# EAGLE schematic AutoPad-R1-RevA (EAGLE 9.6.2), part 2 of 2
## Sheet 6 of 6
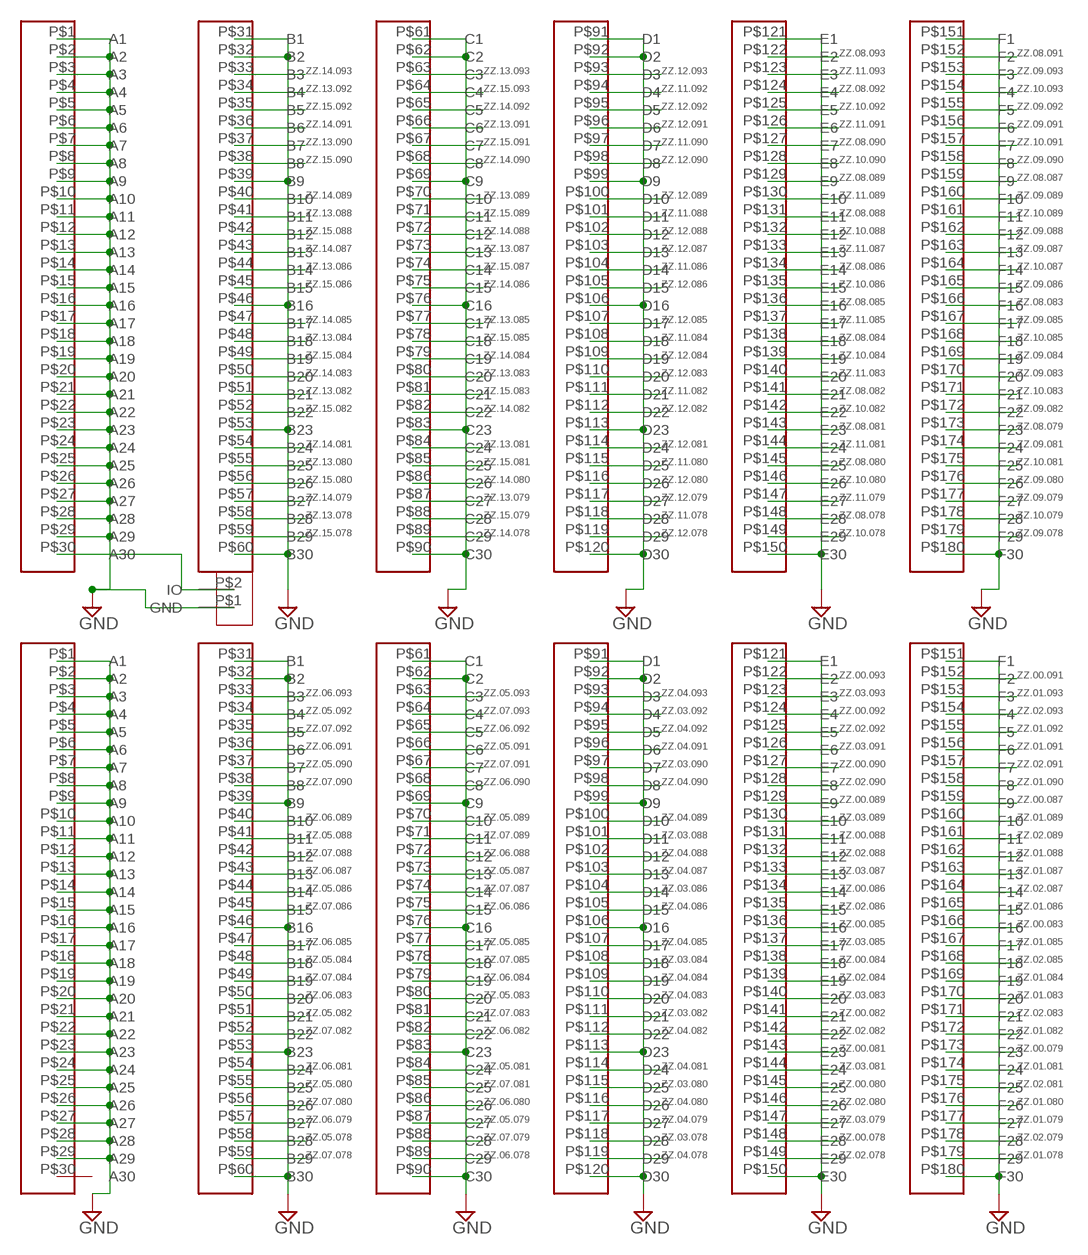
[diagram p5: schematic, sheet 6]

### Parts
U$11  SEAM-30-02.0-L-06-1-A-K-TR  [SEAM-30-02.0-L-06-1-A-K-TR]
U$12  SEAM-30-02.0-L-06-1-A-K-TR  [SEAM-30-02.0-L-06-1-A-K-TR]
U$18  DS2431  [SD2431]

### Nets
GND: U$11.P$1(A1) U$11.P$2(A2) U$11.P$3(A3) U$11.P$4(A4) U$11.P$5(A5) U$11.P$6(A6) U$11.P$7(A7) U$11.P$8(A8) U$11.P$9(A9) U$11.P$10(A10) U$11.P$11(A11) U$11.P$12(A12) U$11.P$13(A13) U$11.P$14(A14) U$11.P$15(A15) U$11.P$16(A16) U$11.P$17(A17) U$11.P$18(A18) U$11.P$19(A19) U$11.P$20(A20) U$11.P$21(A21) U$11.P$22(A22) U$11.P$23(A23) U$11.P$24(A24) U$11.P$25(A25) U$11.P$26(A26) U$11.P$27(A27) U$11.P$28(A28) U$11.P$29(A29) U$11.P$31(B1) U$11.P$32(B2) U$11.P$39(B9) U$11.P$46(B16) U$11.P$53(B23) U$11.P$60(B30) U$11.P$61(C1) U$11.P$62(C2) U$11.P$69(C9) U$11.P$76(C16) U$11.P$83(C23) U$11.P$90(C30) U$11.P$91(D1) U$11.P$92(D2) U$11.P$99(D9) U$11.P$106(D16) U$11.P$113(D23) U$11.P$120(D30) U$11.P$121(E1) U$11.P$150(E30) U$11.P$151(F1) U$11.P$180(F30) U$12.P$1(A1) U$12.P$2(A2) U$12.P$3(A3) U$12.P$4(A4) U$12.P$5(A5) U$12.P$6(A6) U$12.P$7(A7) U$12.P$8(A8) U$12.P$9(A9) U$12.P$10(A10) U$12.P$11(A11) U$12.P$12(A12) U$12.P$13(A13) U$12.P$14(A14) U$12.P$15(A15) U$12.P$16(A16) U$12.P$17(A17) U$12.P$18(A18) U$12.P$19(A19) U$12.P$20(A20) U$12.P$21(A21) U$12.P$22(A22) U$12.P$23(A23) U$12.P$24(A24) U$12.P$25(A25) U$12.P$26(A26) U$12.P$27(A27) U$12.P$28(A28) U$12.P$29(A29) U$12.P$31(B1) U$12.P$32(B2) U$12.P$39(B9) U$12.P$46(B16) U$12.P$53(B23) U$12.P$60(B30) U$12.P$61(C1) U$12.P$62(C2) U$12.P$69(C9) U$12.P$76(C16) U$12.P$83(C23) U$12.P$90(C30) U$12.P$91(D1) U$12.P$92(D2) U$12.P$99(D9) U$12.P$106(D16) U$12.P$113(D23) U$12.P$120(D30) U$12.P$121(E1) U$12.P$150(E30) U$12.P$151(F1) U$12.P$180(F30) U$18.P$1(GND) ; also sheet 1,2,3,4,5
N$6: U$11.P$30(A30) U$18.P$2(IO)
ZZ.00.078: U$12.P$148(E28)
ZZ.00.079: U$12.P$173(F23)
ZZ.00.080: U$12.P$145(E25)
ZZ.00.081: U$12.P$143(E23)
ZZ.00.082: U$12.P$141(E21)
ZZ.00.083: U$12.P$166(F16)
ZZ.00.084: U$12.P$138(E18)
ZZ.00.085: U$12.P$136(E16)
ZZ.00.086: U$12.P$134(E14)
ZZ.00.087: U$12.P$159(F9)
ZZ.00.088: U$12.P$131(E11)
ZZ.00.089: U$12.P$129(E9)
ZZ.00.090: U$12.P$127(E7)
ZZ.00.091: U$12.P$152(F2)
ZZ.00.092: U$12.P$124(E4)
ZZ.00.093: U$12.P$122(E2)
ZZ.01.078: U$12.P$179(F29)
ZZ.01.079: U$12.P$177(F27)
ZZ.01.080: U$12.P$176(F26)
ZZ.01.081: U$12.P$174(F24)
ZZ.01.082: U$12.P$172(F22)
ZZ.01.083: U$12.P$170(F20)
ZZ.01.084: U$12.P$169(F19)
ZZ.01.085: U$12.P$167(F17)
ZZ.01.086: U$12.P$165(F15)
ZZ.01.087: U$12.P$163(F13)
ZZ.01.088: U$12.P$162(F12)
ZZ.01.089: U$12.P$160(F10)
ZZ.01.090: U$12.P$158(F8)
ZZ.01.091: U$12.P$156(F6)
ZZ.01.092: U$12.P$155(F5)
ZZ.01.093: U$12.P$153(F3)
ZZ.02.078: U$12.P$149(E29)
ZZ.02.079: U$12.P$178(F28)
ZZ.02.080: U$12.P$146(E26)
ZZ.02.081: U$12.P$175(F25)
ZZ.02.082: U$12.P$142(E22)
ZZ.02.083: U$12.P$171(F21)
ZZ.02.084: U$12.P$139(E19)
ZZ.02.085: U$12.P$168(F18)
ZZ.02.086: U$12.P$135(E15)
ZZ.02.087: U$12.P$164(F14)
ZZ.02.088: U$12.P$132(E12)
ZZ.02.089: U$12.P$161(F11)
ZZ.02.090: U$12.P$128(E8)
ZZ.02.091: U$12.P$157(F7)
ZZ.02.092: U$12.P$125(E5)
ZZ.02.093: U$12.P$154(F4)
ZZ.03.078: U$12.P$118(D28)
ZZ.03.079: U$12.P$147(E27)
ZZ.03.080: U$12.P$115(D25)
ZZ.03.081: U$12.P$144(E24)
ZZ.03.082: U$12.P$111(D21)
ZZ.03.083: U$12.P$140(E20)
ZZ.03.084: U$12.P$108(D18)
ZZ.03.085: U$12.P$137(E17)
ZZ.03.086: U$12.P$104(D14)
ZZ.03.087: U$12.P$133(E13)
ZZ.03.088: U$12.P$101(D11)
ZZ.03.089: U$12.P$130(E10)
ZZ.03.090: U$12.P$97(D7)
ZZ.03.091: U$12.P$126(E6)
ZZ.03.092: U$12.P$94(D4)
ZZ.03.093: U$12.P$123(E3)
ZZ.04.078: U$12.P$119(D29)
ZZ.04.079: U$12.P$117(D27)
ZZ.04.080: U$12.P$116(D26)
ZZ.04.081: U$12.P$114(D24)
ZZ.04.082: U$12.P$112(D22)
ZZ.04.083: U$12.P$110(D20)
ZZ.04.084: U$12.P$109(D19)
ZZ.04.085: U$12.P$107(D17)
ZZ.04.086: U$12.P$105(D15)
ZZ.04.087: U$12.P$103(D13)
ZZ.04.088: U$12.P$102(D12)
ZZ.04.089: U$12.P$100(D10)
ZZ.04.090: U$12.P$98(D8)
ZZ.04.091: U$12.P$96(D6)
ZZ.04.092: U$12.P$95(D5)
ZZ.04.093: U$12.P$93(D3)
ZZ.05.078: U$12.P$58(B28)
ZZ.05.079: U$12.P$87(C27)
ZZ.05.080: U$12.P$55(B25)
ZZ.05.081: U$12.P$84(C24)
ZZ.05.082: U$12.P$51(B21)
ZZ.05.083: U$12.P$80(C20)
ZZ.05.084: U$12.P$48(B18)
ZZ.05.085: U$12.P$77(C17)
ZZ.05.086: U$12.P$44(B14)
ZZ.05.087: U$12.P$73(C13)
ZZ.05.088: U$12.P$41(B11)
ZZ.05.089: U$12.P$70(C10)
ZZ.05.090: U$12.P$37(B7)
ZZ.05.091: U$12.P$66(C6)
ZZ.05.092: U$12.P$34(B4)
ZZ.05.093: U$12.P$63(C3)
ZZ.06.078: U$12.P$89(C29)
ZZ.06.079: U$12.P$57(B27)
ZZ.06.080: U$12.P$86(C26)
ZZ.06.081: U$12.P$54(B24)
ZZ.06.082: U$12.P$82(C22)
ZZ.06.083: U$12.P$50(B20)
ZZ.06.084: U$12.P$79(C19)
ZZ.06.085: U$12.P$47(B17)
ZZ.06.086: U$12.P$75(C15)
ZZ.06.087: U$12.P$43(B13)
ZZ.06.088: U$12.P$72(C12)
ZZ.06.089: U$12.P$40(B10)
ZZ.06.090: U$12.P$68(C8)
ZZ.06.091: U$12.P$36(B6)
ZZ.06.092: U$12.P$65(C5)
ZZ.06.093: U$12.P$33(B3)
ZZ.07.078: U$12.P$59(B29)
ZZ.07.079: U$12.P$88(C28)
ZZ.07.080: U$12.P$56(B26)
ZZ.07.081: U$12.P$85(C25)
ZZ.07.082: U$12.P$52(B22)
ZZ.07.083: U$12.P$81(C21)
ZZ.07.084: U$12.P$49(B19)
ZZ.07.085: U$12.P$78(C18)
ZZ.07.086: U$12.P$45(B15)
ZZ.07.087: U$12.P$74(C14)
ZZ.07.088: U$12.P$42(B12)
ZZ.07.089: U$12.P$71(C11)
ZZ.07.090: U$12.P$38(B8)
ZZ.07.091: U$12.P$67(C7)
ZZ.07.092: U$12.P$35(B5)
ZZ.07.093: U$12.P$64(C4)
ZZ.08.078: U$11.P$148(E28)
ZZ.08.079: U$11.P$173(F23)
ZZ.08.080: U$11.P$145(E25)
ZZ.08.081: U$11.P$143(E23)
ZZ.08.082: U$11.P$141(E21)
ZZ.08.083: U$11.P$166(F16)
ZZ.08.084: U$11.P$138(E18)
ZZ.08.085: U$11.P$136(E16)
ZZ.08.086: U$11.P$134(E14)
ZZ.08.087: U$11.P$159(F9)
ZZ.08.088: U$11.P$131(E11)
ZZ.08.089: U$11.P$129(E9)
ZZ.08.090: U$11.P$127(E7)
ZZ.08.091: U$11.P$152(F2)
ZZ.08.092: U$11.P$124(E4)
ZZ.08.093: U$11.P$122(E2)
ZZ.09.078: U$11.P$179(F29)
ZZ.09.079: U$11.P$177(F27)
ZZ.09.080: U$11.P$176(F26)
ZZ.09.081: U$11.P$174(F24)
ZZ.09.082: U$11.P$172(F22)
ZZ.09.083: U$11.P$170(F20)
ZZ.09.084: U$11.P$169(F19)
ZZ.09.085: U$11.P$167(F17)
ZZ.09.086: U$11.P$165(F15)
ZZ.09.087: U$11.P$163(F13)
ZZ.09.088: U$11.P$162(F12)
ZZ.09.089: U$11.P$160(F10)
ZZ.09.090: U$11.P$158(F8)
ZZ.09.091: U$11.P$156(F6)
ZZ.09.092: U$11.P$155(F5)
ZZ.09.093: U$11.P$153(F3)
ZZ.10.078: U$11.P$149(E29)
ZZ.10.079: U$11.P$178(F28)
ZZ.10.080: U$11.P$146(E26)
ZZ.10.081: U$11.P$175(F25)
ZZ.10.082: U$11.P$142(E22)
ZZ.10.083: U$11.P$171(F21)
ZZ.10.084: U$11.P$139(E19)
ZZ.10.085: U$11.P$168(F18)
ZZ.10.086: U$11.P$135(E15)
ZZ.10.087: U$11.P$164(F14)
ZZ.10.088: U$11.P$132(E12)
ZZ.10.089: U$11.P$161(F11)
ZZ.10.090: U$11.P$128(E8)
ZZ.10.091: U$11.P$157(F7)
ZZ.10.092: U$11.P$125(E5)
ZZ.10.093: U$11.P$154(F4)
ZZ.11.078: U$11.P$118(D28)
ZZ.11.079: U$11.P$147(E27)
ZZ.11.080: U$11.P$115(D25)
ZZ.11.081: U$11.P$144(E24)
ZZ.11.082: U$11.P$111(D21)
ZZ.11.083: U$11.P$140(E20)
ZZ.11.084: U$11.P$108(D18)
ZZ.11.085: U$11.P$137(E17)
ZZ.11.086: U$11.P$104(D14)
ZZ.11.087: U$11.P$133(E13)
ZZ.11.088: U$11.P$101(D11)
ZZ.11.089: U$11.P$130(E10)
ZZ.11.090: U$11.P$97(D7)
ZZ.11.091: U$11.P$126(E6)
ZZ.11.092: U$11.P$94(D4)
ZZ.11.093: U$11.P$123(E3)
ZZ.12.078: U$11.P$119(D29)
ZZ.12.079: U$11.P$117(D27)
ZZ.12.080: U$11.P$116(D26)
ZZ.12.081: U$11.P$114(D24)
ZZ.12.082: U$11.P$112(D22)
ZZ.12.083: U$11.P$110(D20)
ZZ.12.084: U$11.P$109(D19)
ZZ.12.085: U$11.P$107(D17)
ZZ.12.086: U$11.P$105(D15)
ZZ.12.087: U$11.P$103(D13)
ZZ.12.088: U$11.P$102(D12)
ZZ.12.089: U$11.P$100(D10)
ZZ.12.090: U$11.P$98(D8)
ZZ.12.091: U$11.P$96(D6)
ZZ.12.092: U$11.P$95(D5)
ZZ.12.093: U$11.P$93(D3)
ZZ.13.078: U$11.P$58(B28)
ZZ.13.079: U$11.P$87(C27)
ZZ.13.080: U$11.P$55(B25)
ZZ.13.081: U$11.P$84(C24)
ZZ.13.082: U$11.P$51(B21)
ZZ.13.083: U$11.P$80(C20)
ZZ.13.084: U$11.P$48(B18)
ZZ.13.085: U$11.P$77(C17)
ZZ.13.086: U$11.P$44(B14)
ZZ.13.087: U$11.P$73(C13)
ZZ.13.088: U$11.P$41(B11)
ZZ.13.089: U$11.P$70(C10)
ZZ.13.090: U$11.P$37(B7)
ZZ.13.091: U$11.P$66(C6)
ZZ.13.092: U$11.P$34(B4)
ZZ.13.093: U$11.P$63(C3)
ZZ.14.078: U$11.P$89(C29)
ZZ.14.079: U$11.P$57(B27)
ZZ.14.080: U$11.P$86(C26)
ZZ.14.081: U$11.P$54(B24)
ZZ.14.082: U$11.P$82(C22)
ZZ.14.083: U$11.P$50(B20)
ZZ.14.084: U$11.P$79(C19)
ZZ.14.085: U$11.P$47(B17)
ZZ.14.086: U$11.P$75(C15)
ZZ.14.087: U$11.P$43(B13)
ZZ.14.088: U$11.P$72(C12)
ZZ.14.089: U$11.P$40(B10)
ZZ.14.090: U$11.P$68(C8)
ZZ.14.091: U$11.P$36(B6)
ZZ.14.092: U$11.P$65(C5)
ZZ.14.093: U$11.P$33(B3)
ZZ.15.078: U$11.P$59(B29)
ZZ.15.079: U$11.P$88(C28)
ZZ.15.080: U$11.P$56(B26)
ZZ.15.081: U$11.P$85(C25)
ZZ.15.082: U$11.P$52(B22)
ZZ.15.083: U$11.P$81(C21)
ZZ.15.084: U$11.P$49(B19)
ZZ.15.085: U$11.P$78(C18)
ZZ.15.086: U$11.P$45(B15)
ZZ.15.087: U$11.P$74(C14)
ZZ.15.088: U$11.P$42(B12)
ZZ.15.089: U$11.P$71(C11)
ZZ.15.090: U$11.P$38(B8)
ZZ.15.091: U$11.P$67(C7)
ZZ.15.092: U$11.P$35(B5)
ZZ.15.093: U$11.P$64(C4)
Unconnected: U$12.P$30(A30)

## Library data of the parts
R.1-R.16 = rcl:R-US_: RESISTOR, American symbol; SPICEPREFIX: R
U$1-U$12 = SEAM-30-02.0-L-06-1-A-K-TR-offset-origin:SEAM-30-02.0-L-06-1-A-K-TR
U$13-U$18 = DS2431-Hemmick:DS2431